# Altium schematic sheet PD.SchDoc
size A4; SheetNumber: 3; SheetTotal: 3
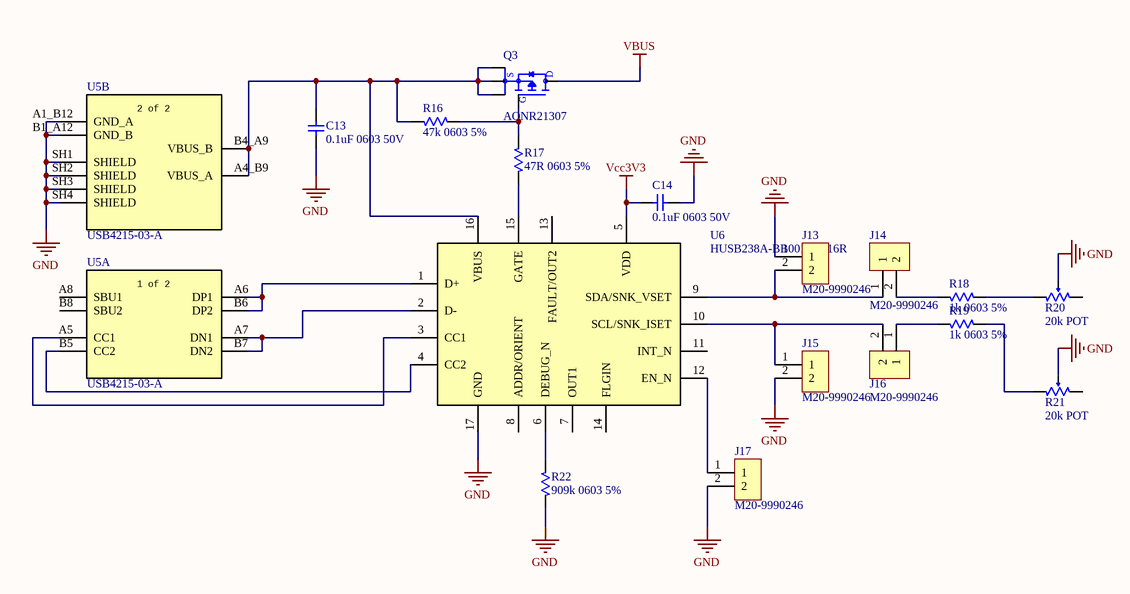
[diagram p0: PD.SchDoc]

## Parts
C13  0.1uF 0603 50V  [CAP_0603]
C14  0.1uF 0603 50V  [CAP_0603]
J13  M20-9990246  [Header_Male_1x2_2.54mm]
J14  M20-9990246  [Header_Male_1x2_2.54mm]
J15  M20-9990246  [Header_Male_1x2_2.54mm]
J16  M20-9990246  [Header_Male_1x2_2.54mm]
J17  M20-9990246  [Header_Male_1x2_2.54mm]
Q3  AONR21307  [DFN 3x3 EP]
R16  47k 0603 5%  [RES_0603]
R17  47R 0603 5%  [RES_0603]
R18  1k 0603 5%  [RES_0603]
R19  1k 0603 5%  [RES_0603]
R20  20k POT  [TRIM_3296W-1-203LF]
R21  20k POT  [TRIM_3296W-1-203LF]
R22  909k 0603 5%  [RES_0603]
U5  USB4215-03-A  [USB4215-03-A]  (parts A,B of 2)
U6  HUSB238A-BB001-QN16R  [QFN-16]

## Nets
GND: C13.1 C14.2 J13.1 J15.2 J17.2 R20.2 R21.2 R22.1 U5.A1_B12(GND_A) U5.B1_A12(GND_B) U5.SH1(SHIELD) U5.SH2(SHIELD) U5.SH3(SHIELD) U5.SH4(SHIELD) U6.17(GND)
VBUS: Q3.5_6_7_8(D)
Vcc3V3: C14.1 U6.5(VDD)
NetC13_2: C13.2 Q3.1(S1) Q3.2(S2) Q3.3(S3) R16.1 U5.A4_B9(VBUS_A) U5.B4_A9(VBUS_B) U6.16(VBUS)
NetJ13_2: J13.2 J14.1 U6.9(SDA/SNK_VSET)
NetJ14_2: J14.2 R18.1
NetJ15_1: J15.1 J16.2 U6.10(SCL/SNK_ISET)
NetJ16_1: J16.1 R19.1
NetJ17_1: J17.1 U6.12(EN_N)
NetQ3_4: Q3.4(G) R16.2 R17.2
NetR17_1: R17.1 U6.15(GATE)
NetR18_2: R18.2 R20.1
NetR19_2: R19.2 R21.1
NetR22_2: R22.2 U6.6(DEBUG_N)
NetU5_A5: U5.A5(CC1) U6.3(CC1)
NetU5_A6: U5.A6(DP1) U5.B6(DP2) U6.1(D+)
NetU5_A7: U5.A7(DN1) U5.B7(DN2) U6.2(D-)
NetU5_B5: U5.B5(CC2) U6.4(CC2)

Not connected (* = marked no-connect by the designer): R20 3; R21 3; U5 A8(SBU1) B8(SBU2); U6 7(OUT1) 8(ADDR/ORIENT) 11(INT_N) 13(FAULT/OUT2) 14(FLGIN)

## Notes on the sheet
- (in symbol CMP-036-000082-2) S
- (in symbol CMP-036-000093-2, part A) 1 of 2
- (in symbol CMP-036-000093-2, part B) 2 of 2

## Library data of the parts
C13 C14 = CMP-001-00088-6: 50V 0.1uF (100nF) X7R ±10% 0603 Multilayer Ceramic Capacitors MLCC - SMD/SMT ROHS; Manufacturer Part Number: CL10B104KB8NNNC; Manufacturer: Samsung Electro-Mechanics; ComponentLink8Description: https://datasheet.octopart.com/General-Multilayer-Ceramic-Capacitors-Samsung-datasheet-family-111.pdf; Thickness: 889µm; ComponentLink15Description: http://sigma.octopart.com:80/rohs_certificate/General-Multilayer-Ceramic-Capacitors-Samsung-family-110.pdf?src-supplier=Compliance+Statements; Lifecycle Status: Production; ComponentLink16Description: http://sigma.octopart.com:80/rohs_statement/General-Multilayer-Ceramic-Capacitors-Samsung-family-132.pdf?src-supplier=Compliance+Statements; ComponentLink9URL: https://datasheet.octopart.com:443/CL10B104KB8NNNC-Samsung-Electro-Mechanics-datasheet-136482302.pdf?src-supplier=Samsung+SCT; ComponentLink17URL: http://sigma.octopart.com:80/reach_statement/General-Multilayer-Ceramic-Capacitors-Samsung-family-133.pdf?src-supplier=Compliance+Statements; Schedule B: 8532240020, 8532240020; JLCPCB Part Number: C1591; Material: Ceramic; REACH SVHC: Yes; Width: 800µm; ComponentLink16URL: http://sigma.octopart.com:80/rohs_statement/General-Multilayer-Ceramic-Capacitors-Samsung-family-132.pdf?src-supplier=Compliance+Statements; Source: MySchLib.SchLib; ComponentLink12URL: https://datasheet.octopart.com:443/CL10B104KB8NNNC-Samsung-Electro-Mechanics-datasheet-149136784.pdf?src-supplier=Future+Electronics; ComponentLink7Description: https://datasheet.octopart.com/CL10B104KB8NNNC-Samsung-Electro-Mechanics-datasheet-97040617.pdf; ComponentLink14Description: https://datasheet.octopart.com:443/CL10B104KB8NNNC-Samsung-Electro-Mechanics-datasheet-11837008.pdf?src-supplier=Arrow+Electronics; Design Item ID: CL10B104KB8NNNC; ComponentLink1URL: https://datasheet.octopart.com:443/CL10B104KB8NNNC-Samsung-datasheet-165517828.pdf?src-supplier=Upverter; ComponentLink1Description: https://datasheet.octopart.com:443/CL10B104KB8NNNC-Samsung-datasheet-165517828.pdf?src-supplier=Upverter; Tolerance: 10%; Min Operating Temperature: -55°C; Max Operating Temperature: 125°C; ComponentLink3URL: https://datasheet.octopart.com:443/CL10B104KB8NNNC-Samsung-Electro-Mechanics-datasheet-81461840.pdf?src-supplier=Upverter; ComponentLink2URL: https://datasheet.octopart.com:443/CL10B104KB8NNNC-Samsung-Electro-Mechanics-datasheet-116890969.pdf?src-supplier=Upverter; Pin Count: 2; Voltage: 50V; Voltage Rating: 50V; Category: Ceramic Capacitors; ComponentLink9Description: https://datasheet.octopart.com:443/CL10B104KB8NNNC-Samsung-Electro-Mechanics-datasheet-136482302.pdf?src-supplier=Samsung+SCT; Dielectric Material: Ceramic; ComponentLink11URL: https://datasheet.octopart.com:443/CL10B104KB8NNNC-Samsung-datasheet-26589154.pdf?src-supplier=Future+Electronics; ComponentLink2Description: https://datasheet.octopart.com:443/CL10B104KB8NNNC-Samsung-Electro-Mechanics-datasheet-116890969.pdf?src-supplier=Upverter; Stock: 8176073; ComponentLink4URL: https://datasheet.octopart.com:443/CL10B104KB8NNNC-Samsung-Electro-Mechanics-datasheet-181551448.pdf?src-supplier=Newark; RoHS: Compliant; China RoHS: Compliant; ComponentLink17Description: http://sigma.octopart.com:80/reach_statement/General-Multilayer-Ceramic-Capacitors-Samsung-family-133.pdf?src-supplier=Compliance+Statements; Radiation Hardening: No; ComponentLink6URL: https://datasheet.octopart.com/CL10B104KB8NNNC-Samsung-Electro-Mechanics-datasheet-8324245.pdf; Voltage Rating (DC): 50V; Contact Plating: Tin; ComponentLink11Description: https://datasheet.octopart.com:443/CL10B104KB8NNNC-Samsung-datasheet-26589154.pdf?src-supplier=Future+Electronics; ComponentLink5URL: https://datasheet.octopart.com:443/CL10B104KB8NNNC-Samsung-Electro-Mechanics-datasheet-181551449.pdf?src-supplier=Newark; Lead Free: Lead Free; Dielectric: X7R; ComponentLink8URL: https://datasheet.octopart.com/General-Multilayer-Ceramic-Capacitors-Samsung-datasheet-family-111.pdf; Height: 900µm; ComponentLink12Description: https://datasheet.octopart.com:443/CL10B104KB8NNNC-Samsung-Electro-Mechanics-datasheet-149136784.pdf?src-supplier=Future+Electronics; Case Code (Imperial): 0603; Pricing: 1=0.1, 10=0.027, 50=0.018, 100=0.0153, 500=0.0108, 1000=0.00941 (USD); ComponentLink5Description: https://datasheet.octopart.com:443/CL10B104KB8NNNC-Samsung-Electro-Mechanics-datasheet-181551449.pdf?src-supplier=Newark; ComponentLink7URL: https://datasheet.octopart.com/CL10B104KB8NNNC-Samsung-Electro-Mechanics-datasheet-97040617.pdf; ComponentLink14URL: https://datasheet.octopart.com:443/CL10B104KB8NNNC-Samsung-Electro-Mechanics-datasheet-11837008.pdf?src-supplier=Arrow+Electronics; Value: 100nF; ComponentLink13URL: https://datasheet.octopart.com:443/CL10B104KB8NNNC-Samsung-datasheet-22147433.pdf?src-supplier=TME; Length: 1.6mm; ComponentLink10Description: https://datasheet.octopart.com:443/CL10B104KB8NNNC-Samsung-datasheet-42770373.pdf?src-supplier=Future+Electronics; Case/Package: 0603; ComponentLink4Description: https://datasheet.octopart.com:443/CL10B104KB8NNNC-Samsung-Electro-Mechanics-datasheet-181551448.pdf?src-supplier=Newark; ComponentLink6Description: https://datasheet.octopart.com/CL10B104KB8NNNC-Samsung-Electro-Mechanics-datasheet-8324245.pdf; Component Type: Standard; Number of Terminals: 2; Depth: 800µm; Case Code (Metric): 1608; Mounting Technology: Surface Mount; ComponentLink15URL: http://sigma.octopart.com:80/rohs_certificate/General-Multilayer-Ceramic-Capacitors-Samsung-family-110.pdf?src-supplier=Compliance+Statements; ComponentLink3Description: https://datasheet.octopart.com:443/CL10B104KB8NNNC-Samsung-Electro-Mechanics-datasheet-81461840.pdf?src-supplier=Upverter; ComponentLink10URL: https://datasheet.octopart.com:443/CL10B104KB8NNNC-Samsung-datasheet-42770373.pdf?src-supplier=Future+Electronics; ComponentLink13Description: https://datasheet.octopart.com:443/CL10B104KB8NNNC-Samsung-datasheet-22147433.pdf?src-supplier=TME
J13-J17 = CMP-002-00077-2: Header Male 1x2 2.54mm; Manufacturer: Harwin; Number of Positions: 2; Voltage Rating (AC): 750V; Connector Type: Male Pin; Max Current Rating: 3A; Contact Resistance: 30mO; Dielectric Material: Polyamide; Insulation Resistance: 1GO; JLCPCB Part Number: C90288; Max Operating Temperature: 105°C; Height: 8.99mm; REACH SVHC: Yes; Radiation Hardening: No; Color: Black; Housing Color: Black; ComponentLink3Description: https://datasheet.octopart.com:443/M20-9990246-Harwin-datasheet-96624206.pdf?src-supplier=element14+APAC; Terminal Pitch: 2.54mm; Export Control Classification Number (ECCN) Code: EAR99; Case/Package: SIL; Introduction Date: 2005-06-27; ComponentLink4Description: https://datasheet.octopart.com:443/M20-9990246-Harwin-datasheet-32864541.pdf?src-supplier=Farnell; ComponentLink5Description: https://datasheet.octopart.com:443/M20-9990246-Harwin-datasheet-7538443.pdf?src-supplier=Farnell; Mounting Technology: Through Hole; ComponentLink5URL: https://datasheet.octopart.com:443/M20-9990246-Harwin-datasheet-7538443.pdf?src-supplier=Farnell; Category: Headers and Wire Housings; Country of Origin: Taiwan; Pitch: 2.54mm; Length: 5.08mm; Pin Count: 2; Lifecycle Status: Production; Contact Mating Length: 6.096mm; Contact Plating: Tin; Termination: Solder; Number of Contacts: 2; Source: MySchLib.SchLib; ComponentLink6Description: https://datasheet.octopart.com:443/M20-9990246-Harwin-datasheet-508868.pdf?src-supplier=Farnell; Housing Material: Nylon; ComponentLink2URL: https://datasheet.octopart.com:443/M20-9990246-Harwin-datasheet-27378916.pdf?src-supplier=Newark; Number of Rows: 1; Current Rating: 3A; Depth: 2.54mm; Lead Pitch: 2.54mm; ComponentLink1URL: https://datasheet.octopart.com:443/M20-9990246-Harwin-datasheet-169407857.pdf?src-supplier=Newark; Min Operating Temperature: -40°C; ComponentLink6URL: https://datasheet.octopart.com:443/M20-9990246-Harwin-datasheet-508868.pdf?src-supplier=Farnell; Pricing: 1=0.1, 10=0.079, 100=0.0669, 500=0.0597, 1000=0.05684, 5000=0.05073, 10000=0.04831 (USD); Gender: Male; Stock: 105807; Contact Material: Brass; Design Item ID: M20-9990246; ComponentLink2Description: https://datasheet.octopart.com:443/M20-9990246-Harwin-datasheet-27378916.pdf?src-supplier=Newark; Pins: 2; ComponentLink1Description: https://datasheet.octopart.com:443/M20-9990246-Harwin-datasheet-169407857.pdf?src-supplier=Newark; Orientation: Straight; Component Type: Standard; Packaging: Bulk; RoHS: Compliant; ComponentLink3URL: https://datasheet.octopart.com:443/M20-9990246-Harwin-datasheet-96624206.pdf?src-supplier=element14+APAC; ComponentLink4URL: https://datasheet.octopart.com:443/M20-9990246-Harwin-datasheet-32864541.pdf?src-supplier=Farnell; Harmonized Tariff Schedule (HTS) Code: 8536.69.40.40; Manufacturer Part Number: M20-9990246
Q3 = CMP-036-000082-2: P-CHANNEL MOSFET 30V 24A 8DFN; Manufacturer: Alpha & Omega Semiconductor; Turn-On Delay Time: 11ns; Drain to Source Resistance: 11mO; Number of Channels: 1; Power Dissipation: 5W; Max Power Dissipation: 28W; Drain to Source Voltage (Vdss): -30V; Turn-Off Delay Time: 43.5ns; Gate to Source Voltage (Vgs): 25V; Max Junction Temperature (Tj): 150°C; ComponentLink3URL: https://sigma.octopart.com:443/138895812/technical_drawing/Alpha-%26-Omega-Semiconductor-AONR21307.pdf?src-supplier=Alpha+%26+Omega+Semiconductor+SCT; REACH SVHC: Yes; Height: 900µm; Stock: 21344; Design Item ID: AONR21307; ComponentLink2URL: https://datasheet.octopart.com:443/AONR21307-Alpha-%26-Omega-Semiconductor-datasheet-136498360.pdf?src-supplier=ODG+(Origin+Data+Global); ComponentLink2Description: https://datasheet.octopart.com:443/AONR21307-Alpha-%26-Omega-Semiconductor-datasheet-136498360.pdf?src-supplier=ODG+(Origin+Data+Global); Category: MOSFETs; JLCPCB Part Number: C3277813; Min Breakdown Voltage: 30V; Pricing: 1=1.24, 10=0.78, 100=0.5123, 500=0.39732, 1000=0.36029, 2000=0.32913 (USD); Manufacturer Part Number: AONR21307; ComponentLink1URL: https://sigma.octopart.com:443/140255651/technical_drawing/Alpha-%26-Omega-Semiconductor-AONR21307.pdf?src-supplier=Upverter; Lifecycle Status: Production; ComponentLink1Description: https://sigma.octopart.com:443/140255651/technical_drawing/Alpha-%26-Omega-Semiconductor-AONR21307.pdf?src-supplier=Upverter; Max Operating Temperature: 150°C; Pin Count: 5; Component Type: Standard; Source: MySchLib.SchLib; Contact Plating: Tin; RoHS: Compliant; ComponentLink3Description: https://sigma.octopart.com:443/138895812/technical_drawing/Alpha-%26-Omega-Semiconductor-AONR21307.pdf?src-supplier=Alpha+%26+Omega+Semiconductor+SCT; Number of Terminals: 8; Drain to Source Breakdown Voltage: -30V; Number of Elements: 1; Min Operating Temperature: -55°C; Continuous Drain Current (ID): 24A
R16 = CMP-009-00177-2: 47k Ohm 0603 5% Chip Resistor SMD; Manufacturer: Royal Ohm; Manufacturer Part Number: 0603WAF4702T5E; Value: 47kO; Temperature Coefficient: 100ppm/°C; Power Rating: 100mW; Working Voltage: 75V; Category: Chip SMD Resistors; Country of Origin: Thailand; Lifecycle Status: Production; Case/Package: 0603; ComponentLink1Description: https://datasheet.octopart.com:443/0603WAF4702T5E-Royal-Ohm-datasheet-157855877.pdf?src-supplier=IHS; REACH SVHC: Yes; Max Operating Temperature: 155°C; Source: MySchLib.SchLib; Component Type: Standard; Mounting Technology: Surface Mount; JLCPCB Part Number: C25819; Min Operating Temperature: -55°C; RoHS: Compliant; Tolerance: 5%; Design Item ID: 0603WAF4702T5E; ComponentLink1URL: https://datasheet.octopart.com:443/0603WAF4702T5E-Royal-Ohm-datasheet-157855877.pdf?src-supplier=IHS; Pin Count: 2; China RoHS: Non-Compliant; Export Control Classification Number (ECCN) Code: EAR99; Stock: 135000; Number of Terminals: 2; Harmonized Tariff Schedule (HTS) Code: 8533.21.00.30; Pricing: 10000=0.001 (USD); Introduction Date: 2016-08-18
R17 = CMP-009-00183-2: 47 Ohm 0603 5% Chip Resistor SMD; Part Series: Thick Film Chip Resistors; Manufacturer Lifecycle Status: ACTIVE; Manufacturer Part Number: ERJ3GEYJ470V; Manufacturer: Panasonic; Working Voltage: 75V; Value: 47O; Power Rating: 100mW; Temperature Coefficient: 200ppm/°C; Tolerance: 5%; Min Operating Temperature: -55°C; Number of Terminations: 2; ComponentLink10URL: https://datasheet.octopart.com:443/ERJ3GEYJ470V-Panasonic-datasheet-8853621.pdf?src-supplier=Future+Electronics; Pin Count: 2; ComponentLink16URL: https://datasheet.octopart.com:443/ERJ3GEYJ470V-Panasonic-datasheet-27908757.pdf?src-supplier=Electro+Sonic; Schedule B: 8533210045, 8533210045; ComponentLink8URL: https://datasheet.octopart.com:443/ERJ3GEYJ470V-Panasonic-datasheet-5313456.pdf?src-supplier=Future+Electronics; Termination: SMD/SMT; ComponentLink13Description: https://datasheet.octopart.com/ERJ3GEYJ470V-Panasonic-datasheet-78375410.pdf; ComponentLink12Description: https://datasheet.octopart.com:443/ERJ3GEYJ470V-Panasonic-datasheet-138819430.pdf?src-supplier=TME; ComponentLink9URL: https://datasheet.octopart.com:443/ERJ3GEYJ470V-Panasonic-datasheet-10025800.pdf?src-supplier=Future+Electronics; JLCPCB Part Number: C1186; ComponentLink1Description: https://datasheet.octopart.com:443/ERJ3GEYJ470V-Panasonic-datasheet-61114972.pdf?src-supplier=Newark; ComponentLink2URL: https://datasheet.octopart.com:443/ERJ3GEYJ470V-Panasonic-datasheet-136608608.pdf?src-supplier=Newark; ComponentLink11URL: https://datasheet.octopart.com:443/ERJ3GEYJ470V-Panasonic-datasheet-13266541.pdf?src-supplier=Future+Electronics; Component Type: Standard; Category: Chip SMD Resistors; Case Code (Imperial): 0603; ComponentLink14Description: https://datasheet.octopart.com:443/ERJ3GEYJ470V-Panasonic-datasheet-7538305.pdf?src-supplier=Jameco; ComponentLink17URL: https://datasheet.octopart.com:443/ERJ3GEYJ470V-Panasonic-datasheet-37173568.pdf?src-supplier=Electro+Sonic; Lead Free: Lead Free; Harmonized Tariff Schedule (HTS) Code: 8533.21.00.30; ComponentLink6Description: https://datasheet.octopart.com:443/ERJ-3GEYJ470V-Panasonic---ECG-datasheet-15994758.pdf?src-supplier=Farnell; ComponentLink13URL: https://datasheet.octopart.com/ERJ3GEYJ470V-Panasonic-datasheet-78375410.pdf; ComponentLink7Description: https://datasheet.octopart.com:443/ERJ-3GEYJ470V-Panasonic-datasheet-147443676.pdf?src-supplier=Master+Electronics; ComponentLink17Description: https://datasheet.octopart.com:443/ERJ3GEYJ470V-Panasonic-datasheet-37173568.pdf?src-supplier=Electro+Sonic; REACH SVHC: Yes; ComponentLink12URL: https://datasheet.octopart.com:443/ERJ3GEYJ470V-Panasonic-datasheet-138819430.pdf?src-supplier=TME; ComponentLink15Description: https://datasheet.octopart.com:443/ERJ-3GEYJ470V-Panasonic-datasheet-118598.pdf?src-supplier=DigiKey; Voltage Rating (DC): 75V; Contact Plating: Tin; Source: MySchLib.SchLib; ComponentLink9Description: https://datasheet.octopart.com:443/ERJ3GEYJ470V-Panasonic-datasheet-10025800.pdf?src-supplier=Future+Electronics; ComponentLink1URL: https://datasheet.octopart.com:443/ERJ3GEYJ470V-Panasonic-datasheet-61114972.pdf?src-supplier=Newark; Military Standard: Not; Height: 450µm; ComponentLink4Description: https://datasheet.octopart.com:443/ERJ-3GEYJ470V-Panasonic-datasheet-5314550.pdf?src-supplier=Farnell; ComponentLink3URL: https://datasheet.octopart.com:443/ERJ3GEYJ470V-Panasonic-datasheet-13266872.pdf?src-supplier=RS+(Formerly+Allied+Electronics); ComponentLink6URL: https://datasheet.octopart.com:443/ERJ-3GEYJ470V-Panasonic---ECG-datasheet-15994758.pdf?src-supplier=Farnell; Design Item ID: ERJ3GEYJ470V; Features: Automotive AEC-Q200; Case/Package: 0603; Number of Terminals: 2; Width: 800µm; ComponentLink14URL: https://datasheet.octopart.com:443/ERJ3GEYJ470V-Panasonic-datasheet-7538305.pdf?src-supplier=Jameco; ComponentLink7URL: https://datasheet.octopart.com:443/ERJ-3GEYJ470V-Panasonic-datasheet-147443676.pdf?src-supplier=Master+Electronics; Country of Origin: Japan, Mainland China; Composition: Thick Film; Radiation Hardening: No; ComponentLink5URL: https://datasheet.octopart.com:443/ERJ3GEYJ470V-Panasonic-datasheet-10554283.pdf?src-supplier=Farnell; Depth: 800µm; Introduction Date: 1998-09-24; ComponentLink2Description: https://datasheet.octopart.com:443/ERJ3GEYJ470V-Panasonic-datasheet-136608608.pdf?src-supplier=Newark; ComponentLink8Description: https://datasheet.octopart.com:443/ERJ3GEYJ470V-Panasonic-datasheet-5313456.pdf?src-supplier=Future+Electronics; Stock: 122467; ComponentLink16Description: https://datasheet.octopart.com:443/ERJ3GEYJ470V-Panasonic-datasheet-27908757.pdf?src-supplier=Electro+Sonic; Packaging: Cut Tape; ComponentLink15URL: https://datasheet.octopart.com:443/ERJ-3GEYJ470V-Panasonic-datasheet-118598.pdf?src-supplier=DigiKey; Ratings: AEC-Q200; ComponentLink10Description: https://datasheet.octopart.com:443/ERJ3GEYJ470V-Panasonic-datasheet-8853621.pdf?src-supplier=Future+Electronics; Max Power Dissipation: 100mW; RoHS: Compliant; Export Control Classification Number (ECCN) Code: EAR99; ComponentLink4URL: https://datasheet.octopart.com:443/ERJ-3GEYJ470V-Panasonic-datasheet-5314550.pdf?src-supplier=Farnell; Length: 1.6mm; ComponentLink11Description: https://datasheet.octopart.com:443/ERJ3GEYJ470V-Panasonic-datasheet-13266541.pdf?src-supplier=Future+Electronics; ComponentLink5Description: https://datasheet.octopart.com:443/ERJ3GEYJ470V-Panasonic-datasheet-10554283.pdf?src-supplier=Farnell; ComponentLink3Description: https://datasheet.octopart.com:443/ERJ3GEYJ470V-Panasonic-datasheet-13266872.pdf?src-supplier=RS+(Formerly+Allied+Electronics); Voltage Rating: 75V; Lifecycle Status: Production; Mounting Technology: Surface Mount; Pricing: 1=0.1, 10=0.023, 50=0.023, 100=0.019, 1000=0.011, 10000=0.006 (USD); Max Operating Temperature: 155°C
R18 R19 = CMP-009-00185-2: 1k 0603 5% Chip Resistor SMD; Manufacturer: Yageo Group; Manufacturer Part Number: RC0603JR-071KL; Power Rating: 100mW; Temperature Coefficient: 100ppm/°C; Value: 1kO; Working Voltage: 75V; Voltage Rating (AC): 50V; ComponentLink6URL: https://datasheet.octopart.com:443/RC0603JR-071KL-Yageo-Group-datasheet-176638170.pdf?src-supplier=Future+Electronics; REACH SVHC: Yes; Source: MySchLib.SchLib; Case/Package: 0603; ComponentLink11URL: https://datasheet.octopart.com:443/RC0603JR-071KL-Yageo-datasheet-15599030.pdf?src-supplier=Future+Electronics; ComponentLink15Description: https://datasheet.octopart.com:443/RC0603JR-071KL-Yageo-datasheet-118562.pdf?src-supplier=DigiKey; ComponentLink7Description: https://datasheet.octopart.com:443/RC0603JR-071KL-Yageo-datasheet-164759695.pdf?src-supplier=Future+Electronics; China RoHS: Non-Compliant; Number of Terminals: 2; Category: Chip SMD Resistors; Component Type: Standard; Min Operating Temperature: -55°C; Packaging: Cut Tape; ComponentLink3Description: https://datasheet.octopart.com:443/RC0603JR-071KL-Yageo-datasheet-8328172.pdf?src-supplier=Upverter; ComponentLink1Description: https://datasheet.octopart.com:443/RC0603JR-071KL-Yageo-datasheet-175887523.pdf?src-supplier=Newark; Pricing: 1=0.1, 10=0.022, 25=0.0156, 50=0.0124, 100=0.010, 250=0.00764, 500=0.00632, 1000=0.00529 (USD); Design Item ID: RC0603JR-071KL; JLCPCB Part Number: C14676; Contact Plating: Tin; ComponentLink8URL: https://datasheet.octopart.com:443/RC0603JR-071KL-Yageo-datasheet-137700087.pdf?src-supplier=Future+Electronics; Mounting Technology: Surface Mount; ComponentLink17URL: http://sigma.octopart.com:80/rohs_statement/Yageo-company-2.pdf?src-supplier=Compliance+Statements; ComponentLink2Description: https://datasheet.octopart.com:443/RC0603JR-071KL-Yageo-datasheet-34211833.pdf?src-supplier=Newark; ComponentLink5URL: https://datasheet.octopart.com:443/RC0603JR-071KL-Yageo-datasheet-62067350.pdf?src-supplier=element14+APAC; ComponentLink4URL: https://datasheet.octopart.com:443/RC0603JR-071KL-Yageo-datasheet-68297981.pdf?src-supplier=Upverter; Tolerance: 5%; Composition: Thick Film; ComponentLink7URL: https://datasheet.octopart.com:443/RC0603JR-071KL-Yageo-datasheet-164759695.pdf?src-supplier=Future+Electronics; ComponentLink8Description: https://datasheet.octopart.com:443/RC0603JR-071KL-Yageo-datasheet-137700087.pdf?src-supplier=Future+Electronics; ComponentLink9Description: https://datasheet.octopart.com:443/RC0603JR071KL-Yageo-datasheet-27584510.pdf?src-supplier=Future+Electronics; ComponentLink12Description: https://datasheet.octopart.com:443/RC0603JR-071KL-Yageo-datasheet-12596169.pdf?src-supplier=Future+Electronics; ComponentLink9URL: https://datasheet.octopart.com:443/RC0603JR071KL-Yageo-datasheet-27584510.pdf?src-supplier=Future+Electronics; Pin Count: 2; Depth: 800µm; ComponentLink6Description: https://datasheet.octopart.com:443/RC0603JR-071KL-Yageo-Group-datasheet-176638170.pdf?src-supplier=Future+Electronics; ComponentLink17Description: http://sigma.octopart.com:80/rohs_statement/Yageo-company-2.pdf?src-supplier=Compliance+Statements; Pins: 2; Military Standard: Not; ComponentLink16Description: http://sigma.octopart.com:80/conflict_mineral_statement/Yageo-company-3.pdf?src-supplier=Compliance+Statements; Lifecycle Status: Production; Termination: SMD/SMT; ComponentLink10URL: https://datasheet.octopart.com:443/RC0603JR-071KL-Yageo-datasheet-17842380.pdf?src-supplier=Future+Electronics; ComponentLink1URL: https://datasheet.octopart.com:443/RC0603JR-071KL-Yageo-datasheet-175887523.pdf?src-supplier=Newark; ComponentLink15URL: https://datasheet.octopart.com:443/RC0603JR-071KL-Yageo-datasheet-118562.pdf?src-supplier=DigiKey; ComponentLink10Description: https://datasheet.octopart.com:443/RC0603JR-071KL-Yageo-datasheet-17842380.pdf?src-supplier=Future+Electronics; RoHS: Compliant; Schedule B: 8533210045, 8533210045; Stock: 607059; ComponentLink12URL: https://datasheet.octopart.com:443/RC0603JR-071KL-Yageo-datasheet-12596169.pdf?src-supplier=Future+Electronics; Max Operating Temperature: 155°C; Radiation Hardening: No; ComponentLink13URL: https://datasheet.octopart.com:443/RC0603JR-071KL-Yageo-datasheet-79472498.pdf?src-supplier=Megastar; ComponentLink4Description: https://datasheet.octopart.com:443/RC0603JR-071KL-Yageo-datasheet-68297981.pdf?src-supplier=Upverter; Height: 450µm; ComponentLink13Description: https://datasheet.octopart.com:443/RC0603JR-071KL-Yageo-datasheet-79472498.pdf?src-supplier=Megastar; ComponentLink14URL: https://datasheet.octopart.com/RC0603JR-071KL-Yageo-datasheet-73766026.pdf; Width: 800µm; Lead Free: Lead Free; ComponentLink5Description: https://datasheet.octopart.com:443/RC0603JR-071KL-Yageo-datasheet-62067350.pdf?src-supplier=element14+APAC; ComponentLink3URL: https://datasheet.octopart.com:443/RC0603JR-071KL-Yageo-datasheet-8328172.pdf?src-supplier=Upverter; ComponentLink16URL: http://sigma.octopart.com:80/conflict_mineral_statement/Yageo-company-3.pdf?src-supplier=Compliance+Statements; ComponentLink11Description: https://datasheet.octopart.com:443/RC0603JR-071KL-Yageo-datasheet-15599030.pdf?src-supplier=Future+Electronics; Length: 1.6mm; Voltage Rating (DC): 50V; ComponentLink2URL: https://datasheet.octopart.com:443/RC0603JR-071KL-Yageo-datasheet-34211833.pdf?src-supplier=Newark; Voltage Rating: 50V; ComponentLink14Description: https://datasheet.octopart.com/RC0603JR-071KL-Yageo-datasheet-73766026.pdf; Case Code (Imperial): 0603
R20 R21 = CMP-009-00182-3: 20k Ohm TH Trimmer Potentiometer; Manufacturer: Bourns; Manufacturer Part Number: 3296W-1-203LF; Temperature Coefficient: 100ppm/°C; Power Rating: 500mW; Lead Length: 6.4mm; Voltage Rating (DC): 300V; Value: 20kO; Tolerance: 10%; Lead Diameter: 510µm; Number of Turns: 25; Introduction Date: 2004-09-13; China RoHS: Non-Compliant; ComponentLink5URL: https://datasheet.octopart.com:443/3296W-1-203LF-Bourns-datasheet-9257.pdf?src-supplier=_legacy+Avnet; ComponentLink8Description: https://datasheet.octopart.com:443/3296W-1-203LF-Bourns-datasheet-154729564.pdf?src-supplier=Electro+Sonic; Harmonized Tariff Schedule (HTS) Code: 8533.40.80.50; Termination: Pin; Schedule B: 8533400080, 8533400080; Source: MySchLib.SchLib; Military Standard: Not; Lifecycle Status: Production; Width: 4.83mm; ComponentLink10URL: https://datasheet.octopart.com:443/3296W-1-203LF-Bourns-datasheet-6152.pdf?src-supplier=Farnell; ComponentLink2URL: https://datasheet.octopart.com:443/3296W-1-203LF-Bourns-datasheet-62345832.pdf?src-supplier=Newark; Max Operating Temperature: 125°C; ComponentLink2Description: https://datasheet.octopart.com:443/3296W-1-203LF-Bourns-datasheet-62345832.pdf?src-supplier=Newark; ComponentLink10Description: https://datasheet.octopart.com:443/3296W-1-203LF-Bourns-datasheet-6152.pdf?src-supplier=Farnell; ComponentLink9URL: https://datasheet.octopart.com:443/3296W-1-203LF-Bourns-datasheet-8458046.pdf?src-supplier=Farnell; ComponentLink6URL: https://datasheet.octopart.com:443/3296W-1-203LF-Bourns-datasheet-8359740.pdf?src-supplier=_legacy+Avnet; ComponentLink1Description: https://datasheet.octopart.com:443/3296W-1-203LF-Bourns-datasheet-154325949.pdf?src-supplier=Newark; Taper: Linear; ComponentLink12URL: https://datasheet.octopart.com:443/3296W-1-203LF-Bourns-datasheet-14175298.pdf?src-supplier=iiiC; REACH SVHC: No; Country of Origin: Costa Rica; Design Item ID: 3296W-1-203LF; ComponentLink8URL: https://datasheet.octopart.com:443/3296W-1-203LF-Bourns-datasheet-154729564.pdf?src-supplier=Electro+Sonic; ComponentLink9Description: https://datasheet.octopart.com:443/3296W-1-203LF-Bourns-datasheet-8458046.pdf?src-supplier=Farnell; JLCPCB Part Number: C34845; RoHS: Compliant; Number of Terminals: 3; ComponentLink7URL: https://datasheet.octopart.com:443/3296W-1-203LF-Bourns-datasheet-25360155.pdf?src-supplier=Future+Electronics; Mounting Technology: PCB, Panel, Through Hole; Min Operating Temperature: -55°C; ComponentLink11URL: https://datasheet.octopart.com:443/3296W-1-203LF-Bourns-datasheet-528316.pdf?src-supplier=Farnell; ComponentLink4Description: https://datasheet.octopart.com:443/3296W-1-203LF-Bourns-datasheet-170576125.pdf?src-supplier=Burklin+Elektronik; ComponentLink3Description: https://datasheet.octopart.com:443/3296W-1-203LF-Bourns-datasheet-8754025.pdf?src-supplier=Burklin+Elektronik; ComponentLink14Description: http://sigma.octopart.com:80/conflict_mineral_statement/Bourns-company-36.pdf?src-supplier=Compliance+Statements; ComponentLink5Description: https://datasheet.octopart.com:443/3296W-1-203LF-Bourns-datasheet-9257.pdf?src-supplier=_legacy+Avnet; Length: 9.53mm; Composition: Cermet; Height: 10.03mm; ComponentLink1URL: https://datasheet.octopart.com:443/3296W-1-203LF-Bourns-datasheet-154325949.pdf?src-supplier=Newark; Category: Variable Resistors and Potentiometers; Pin Count: 3; ComponentLink6Description: https://datasheet.octopart.com:443/3296W-1-203LF-Bourns-datasheet-8359740.pdf?src-supplier=_legacy+Avnet; Component Type: Standard; ComponentLink11Description: https://datasheet.octopart.com:443/3296W-1-203LF-Bourns-datasheet-528316.pdf?src-supplier=Farnell; Working Voltage: 300V; ComponentLink3URL: https://datasheet.octopart.com:443/3296W-1-203LF-Bourns-datasheet-8754025.pdf?src-supplier=Burklin+Elektronik; Weight: 850.485694mg; ComponentLink13URL: https://datasheet.octopart.com:443/3296W-1-203LF-Bourns-datasheet-7086880.pdf?src-supplier=Jameco; ComponentLink13Description: https://datasheet.octopart.com:443/3296W-1-203LF-Bourns-datasheet-7086880.pdf?src-supplier=Jameco; Max Power Dissipation: 500mW; Lead Free: Lead Free; Color: Blue; ComponentLink12Description: https://datasheet.octopart.com:443/3296W-1-203LF-Bourns-datasheet-14175298.pdf?src-supplier=iiiC; Export Control Classification Number (ECCN) Code: EAR99; ComponentLink7Description: https://datasheet.octopart.com:443/3296W-1-203LF-Bourns-datasheet-25360155.pdf?src-supplier=Future+Electronics; Depth: 4.83mm; Pricing: 1=2.04, 10=1.702, 25=1.582, 50=1.496, 100=1.4143, 250=1.31268, 500=1.24036, 1000=1.17182, 5000=1.02641 (USD); Contact Plating: Tin; Radiation Hardening: No; ComponentLink4URL: https://datasheet.octopart.com:443/3296W-1-203LF-Bourns-datasheet-170576125.pdf?src-supplier=Burklin+Elektronik; ComponentLink14URL: http://sigma.octopart.com:80/conflict_mineral_statement/Bourns-company-36.pdf?src-supplier=Compliance+Statements
R22 = CMP-009-00178-2: 909k Ohm 0603 1% Chip Resistor SMD; Manufacturer Part Number: 0603WAF9093T5E; Manufacturer: Royal Ohm; Value: 909kO; Temperature Coefficient: 100ppm/°C; Working Voltage: 75V; Power Rating: 100mW; REACH SVHC: Yes; Category: Chip SMD Resistors; ComponentLink1Description: https://datasheet.octopart.com:443/0603WAF9093T5E-Royal-Electronics-datasheet-181080982.pdf?src-supplier=IHS; Min Operating Temperature: -55°C; Pricing: 10000=0.001 (USD); ComponentLink1URL: https://datasheet.octopart.com:443/0603WAF9093T5E-Royal-Electronics-datasheet-181080982.pdf?src-supplier=IHS; Case/Package: 0603; Lifecycle Status: Production; Max Operating Temperature: 155°C; Mounting Technology: Surface Mount; ComponentLink3URL: https://datasheet.octopart.com:443/0603WAF9093T5E-Royal-Ohm-datasheet-157855877.pdf?src-supplier=TME; ComponentLink3Description: https://datasheet.octopart.com:443/0603WAF9093T5E-Royal-Ohm-datasheet-157855877.pdf?src-supplier=TME; ComponentLink2Description: https://datasheet.octopart.com:443/0603WAF9093T5E-Royal-Ohm-datasheet-165785611.pdf?src-supplier=TME; ComponentLink2URL: https://datasheet.octopart.com:443/0603WAF9093T5E-Royal-Ohm-datasheet-165785611.pdf?src-supplier=TME; Pin Count: 2; ComponentLink4URL: https://datasheet.octopart.com:443/0603WAF9093T5E-Royal-Ohm-datasheet-62069544.pdf?src-supplier=TME; Source: MySchLib.SchLib; Design Item ID: 0603WAF9093T5E; Length: 1.6mm; Height: 450µm; RoHS: Compliant; Number of Terminals: 2; Width: 800µm; JLCPCB Part Number: C23262; Component Type: Standard; ComponentLink4Description: https://datasheet.octopart.com:443/0603WAF9093T5E-Royal-Ohm-datasheet-62069544.pdf?src-supplier=TME; Tolerance: 1%
U5 = CMP-036-000093-2: USB-C, 12+4 Contacts 16POS Rohs Compliant: Yes; Manufacturer: Global Connector Technology; Manufacturer Part Number: USB4215-03-A; Source: MySchLib.SchLib; ComponentLink1URL: https://datasheet.octopart.com:443/USB4215-03-A-GCT-datasheet-188869092.pdf?src-supplier=TME; ComponentLink2Description: https://datasheet.octopart.com:443/USB4215-03-A-GCT-datasheet-188936008.pdf?src-supplier=TME; Category: USB Connectors; ComponentLink2URL: https://datasheet.octopart.com:443/USB4215-03-A-GCT-datasheet-188936008.pdf?src-supplier=TME; Orientation: Horizontal; Design Item ID: USB4215-03-A; Pins: 16; JLCPCB Part Number: C165948; Component Type: Standard; Pin Count: 16; Pricing: 1=0.53, 10=0.449, 25=0.4208, 50=0.4006, 100=0.3814, 250=0.35752, 500=0.34044 (USD); Stock: 1071; ComponentLink1Description: https://datasheet.octopart.com:443/USB4215-03-A-GCT-datasheet-188869092.pdf?src-supplier=TME; PartId: 1
U6 = CMP-036-000085-2: USB PD Controller; Component Type: Standard; Design Item ID: HUSB238A-BB001-QN16R; Source: MySchLib.SchLib; JLCPCB Part Number: C24833806; Pin Count: 17